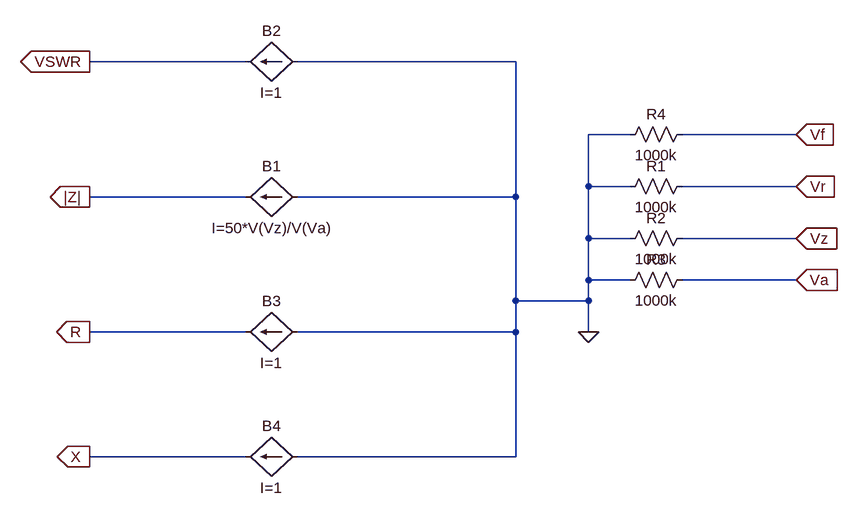
[diagram p0: schematic BridgeAnalyser.asc]
BridgeAnalyser.asc, the LTspice schematic file:
Version 4
SHEET 1 968 680
WIRE 32 -80 -208 -80
WIRE 448 -80 112 -80
WIRE 624 32 560 32
WIRE 880 32 704 32
WIRE 560 112 560 32
WIRE 624 112 560 112
WIRE 880 112 704 112
WIRE 32 128 -208 128
WIRE 448 128 448 -80
WIRE 448 128 112 128
WIRE 560 192 560 112
WIRE 624 192 560 192
WIRE 880 192 704 192
WIRE 560 256 560 192
WIRE 624 256 560 256
WIRE 880 256 704 256
WIRE 448 288 448 128
WIRE 560 288 560 256
WIRE 560 288 448 288
WIRE 32 336 -208 336
WIRE 448 336 448 288
WIRE 448 336 112 336
WIRE 560 336 560 288
WIRE 32 528 -208 528
WIRE 448 528 448 336
WIRE 448 528 112 528
FLAG 880 32 Vf
IOPIN 880 32 In
FLAG 880 112 Vr
IOPIN 880 112 In
FLAG 880 192 Vz
IOPIN 880 192 In
FLAG 880 256 Va
IOPIN 880 256 In
FLAG -208 -80 VSWR
IOPIN -208 -80 Out
FLAG -208 128 |Z|
IOPIN -208 128 Out
FLAG -208 336 R
IOPIN -208 336 Out
FLAG -208 528 X
IOPIN -208 528 Out
FLAG 560 336 0
SYMBOL bi 112 128 R90
WINDOW 0 -32 40 VBottom 2
WINDOW 3 32 40 VTop 2
SYMATTR InstName B1
SYMATTR Value I=50*V(Vz)/V(Va)
SYMBOL res 720 96 R90
WINDOW 0 0 56 VBottom 2
WINDOW 3 32 56 VTop 2
SYMATTR InstName R1
SYMATTR Value 1000k
SYMBOL res 720 176 R90
WINDOW 0 0 56 VBottom 2
WINDOW 3 32 56 VTop 2
SYMATTR InstName R2
SYMATTR Value 1000k
SYMBOL res 720 240 R90
WINDOW 0 0 56 VBottom 2
WINDOW 3 32 56 VTop 2
SYMATTR InstName R3
SYMATTR Value 1000k
SYMBOL res 720 16 R90
WINDOW 0 0 56 VBottom 2
WINDOW 3 32 56 VTop 2
SYMATTR InstName R4
SYMATTR Value 1000k
SYMBOL bi 112 -80 R90
WINDOW 0 -32 40 VBottom 2
WINDOW 3 32 40 VTop 2
SYMATTR InstName B2
SYMATTR Value I=1
SYMBOL bi 112 336 R90
WINDOW 0 -32 40 VBottom 2
WINDOW 3 32 40 VTop 2
SYMATTR InstName B3
SYMATTR Value I=1
SYMBOL bi 112 528 R90
WINDOW 0 -32 40 VBottom 2
WINDOW 3 32 40 VTop 2
SYMATTR InstName B4
SYMATTR Value I=1

The netlist it stands for:
* BridgeAnalyser.asc
B1 0 |Z| I=50*V(Vz)/V(Va)
R1 Vr 0 1000k
R2 Vz 0 1000k
R3 Va 0 1000k
R4 Vf 0 1000k
B2 0 VSWR I=1
B3 0 R I=1
B4 0 X I=1
.backanno
.end